# EAGLE design Day0_Rahmadi Rizki S. Pandia (EAGLE 7.5.0)
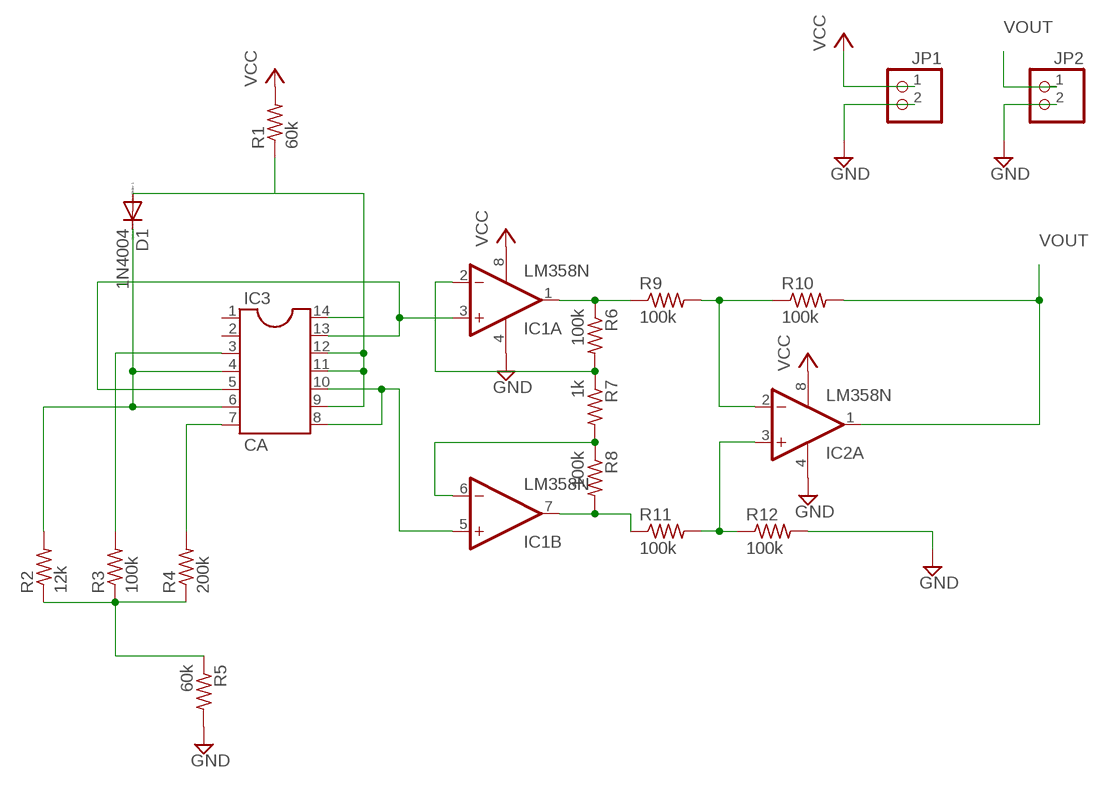
[diagram p0: schematic, sheet 1]

## Parts
D1  1N4004  DIODE-D-7.5  [D-7.5]
IC1  LM358N  [DIL08]
IC2  LM358N  [DIL08]
IC3  CA  DIL14  [DIL14]
JP1  PINHD-1X2  [1X02]
JP2  PINHD-1X2  [1X02]
R1  60k  R-US_0204/7  [0204/7]
R2  12k  R-US_0204/7  [0204/7]
R3  100k  R-US_0204/7  [0204/7]
R4  200k  R-US_0204/7  [0204/7]
R5  60k  R-US_0204/7  [0204/7]
R6  100k  R-US_0204/7  [0204/7]
R7  1k  R-US_0204/7  [0204/7]
R8  100k  R-US_0204/7  [0204/7]
R9  100k  R-US_0204/7  [0204/7]
R10  100k  R-US_0204/7  [0204/7]
R11  100k  R-US_0204/7  [0204/7]
R12  100k  R-US_0204/7  [0204/7]

## Nets
CA3046: IC1.3(A:+IN) IC3.5 IC3.13
GND: IC1.4(P:V-) IC2.4(P:V-) JP1.2 JP2.2 R5.2 R12.2
N$1: D1.A IC3.9 IC3.11 IC3.12 IC3.14 R1.1
N$2: D1.C IC3.4 IC3.6 R2.2
N$4: IC3.3 R3.2
N$5: IC3.7 R4.2
N$6: IC1.2(A:-IN) R6.2 R7.1
N$7: R2.1 R3.1 R4.1 R5.1
N$8: IC1.5(B:+IN) IC3.8 IC3.10
N$9: IC1.6(B:-IN) R7.2 R8.1
N$10: IC1.1(A:OUT) R6.1 R9.1
N$11: IC1.7(B:OUT) R8.2 R11.1
N$12: IC2.2(A:-IN) R9.2 R10.1
N$14: IC2.3(A:+IN) R11.2 R12.1
VCC: IC1.8(P:V+) IC2.8(P:V+) JP1.1 R1.2
VOUT: IC2.1(A:OUT) JP2.1 R10.2
Unconnected: IC2.5(B:+IN) IC2.6(B:-IN) IC2.7(B:OUT) IC3.1 IC3.2

## Library data of the parts
D1 = diode:DIODE-: DIODE
IC1 IC2 = linear:LM358: OP AMP also LM158; LM258; LM2904 Source: http://cache.national.com/ds/LM/LM158.pdf
IC3 = ic-package:DIL14: Dual In Line / Socket
JP1 JP2 = pinhead:PINHD-1X2: PIN HEADER
R1-R12 = rcl:R-US_: RESISTOR, American symbol

## Board
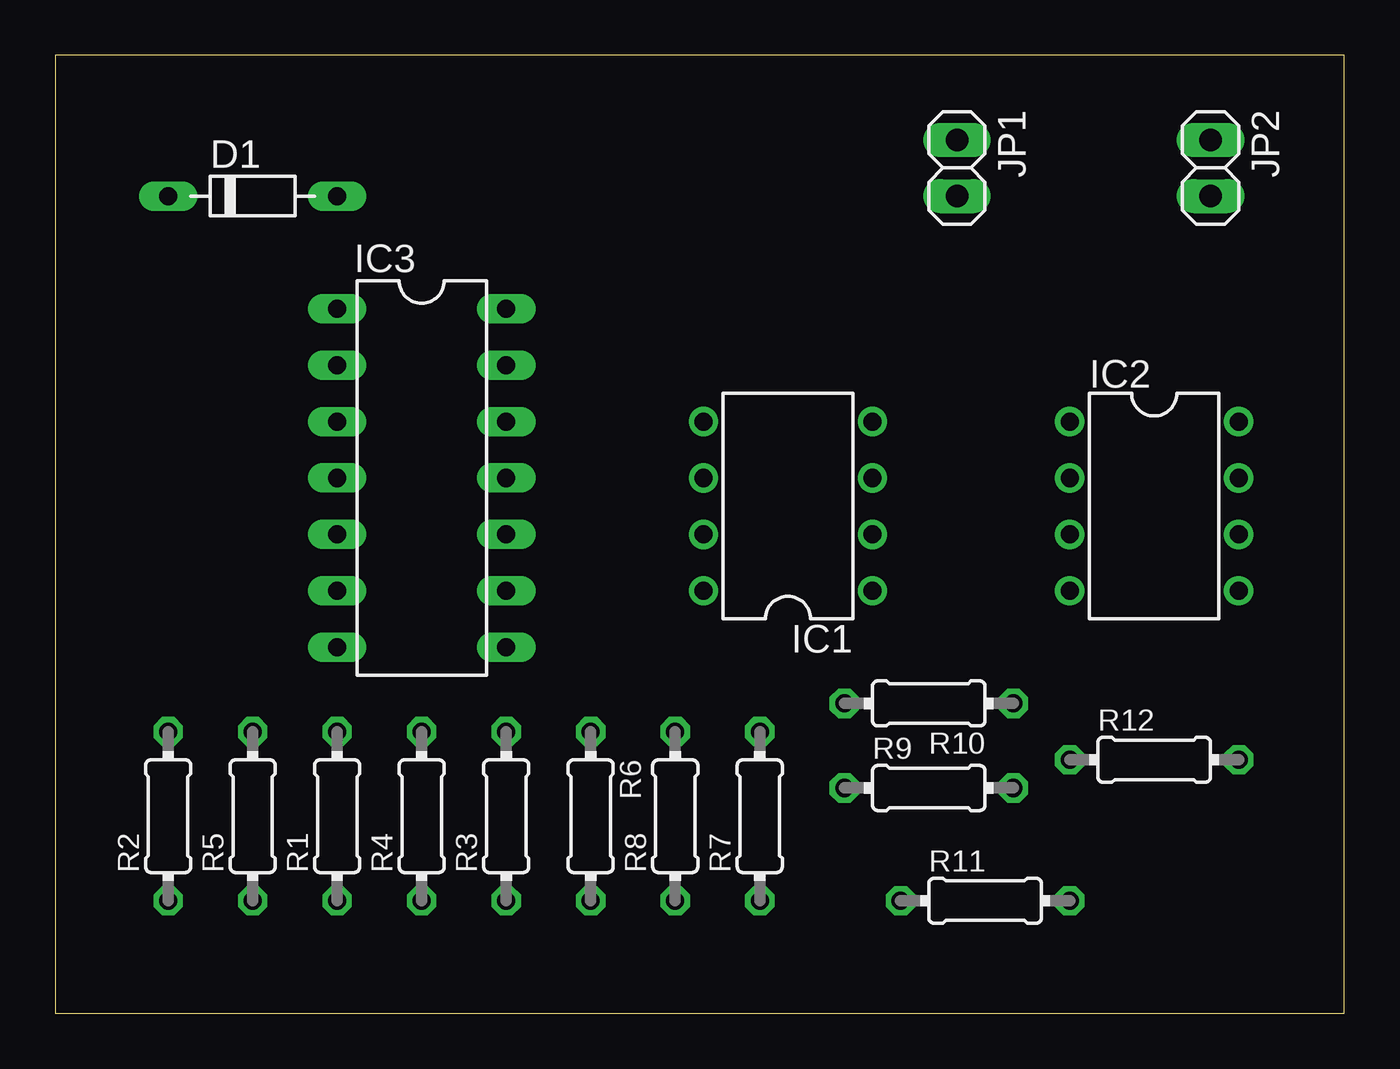
[diagram p1: board, top side]
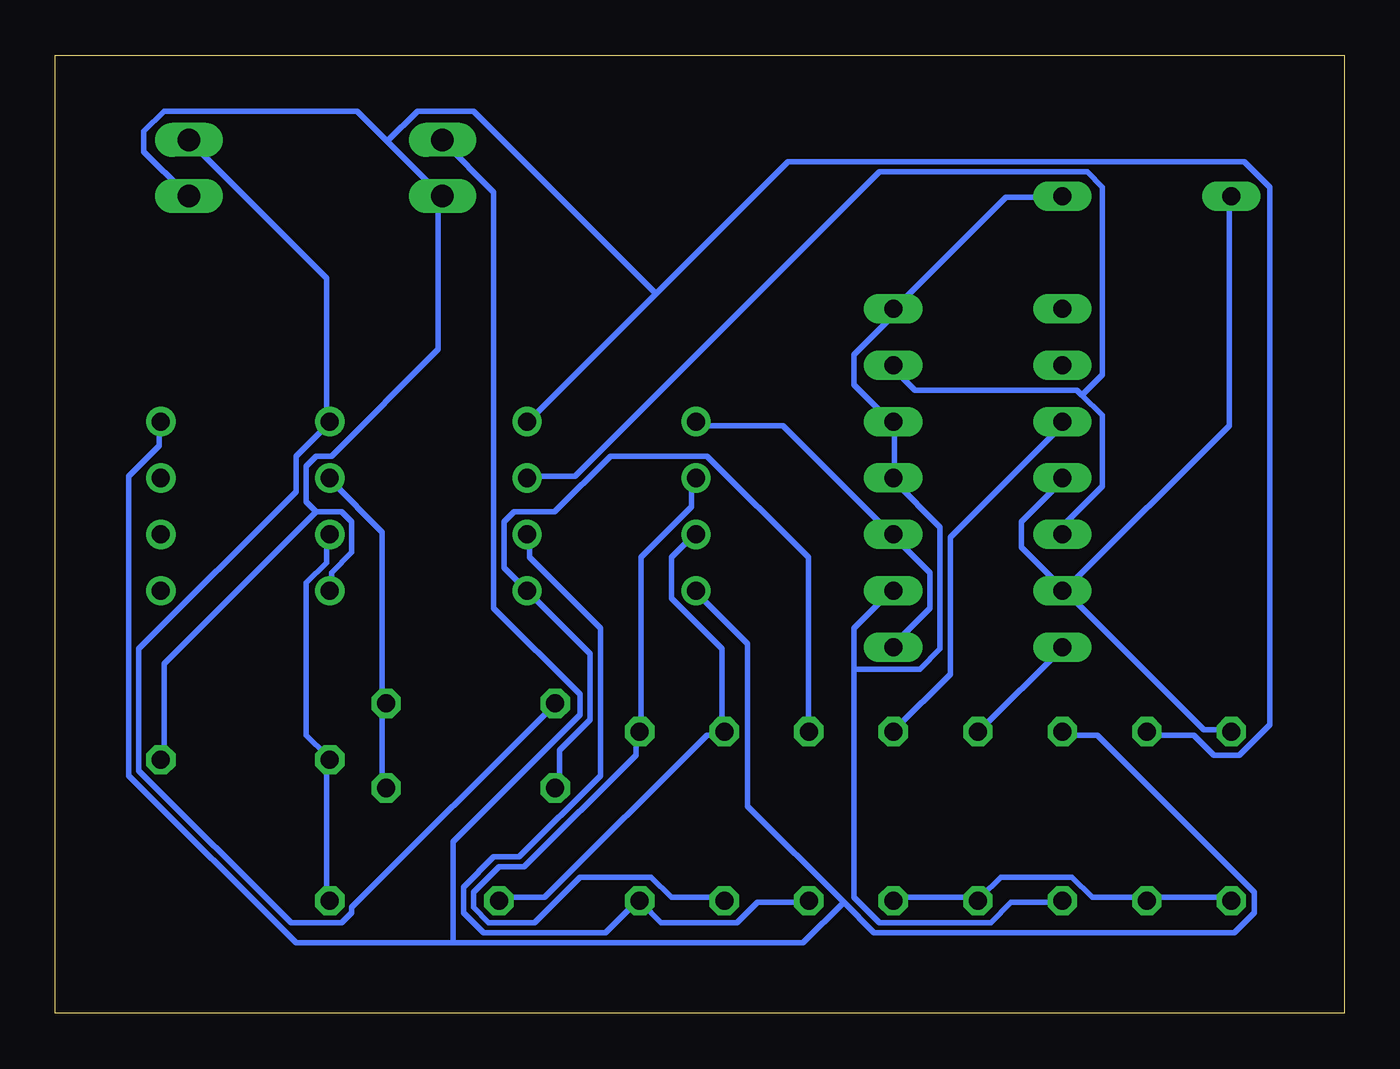
[diagram p2: board, bottom side, seen from below]

Size 58.09 x 43.17 mm. Coordinates in mm from the lower left corner, seen from the top.
Outline: 0,0 58.09,0 58.09,43.17 0,43.17 0,0
Copper layers (1*16): Top 0.035mm / dielectric 1.5mm / Bottom 0.035mm
Design rules "default": minimum track width 10mil, minimum drill 24mil, track to track 8mil, track to pad 8mil, pad to pad 8mil, via to via 8mil, smd to smd 8mil, copper to edge 40mil, drill to drill 8mil, minimum pad ring 10mil, minimum via ring 8mil, stop-mask expansion 4mil, vias tented up to drill 0mil, thermal gap 10mil

### Footprints (pad centres in the part's own frame; a part is rotated, then mirrored left to right if it is on the bottom)
D-7.5 = drill 0.813 long: A 3.81,0; C -3.81,0
DIL08 = drill 0.813 pad 1.27: 1 -3.81,-3.81; 2 -1.27,-3.81; 3 1.27,-3.81; 4 3.81,-3.81; 5 3.81,3.81; 6 1.27,3.81; 7 -1.27,3.81; 8 -3.81,3.81
DIL14 = drill 0.813 long: 1 -7.62,-3.81; 2 -5.08,-3.81; 3 -2.54,-3.81; 4 0,-3.81; 5 2.54,-3.81; 6 5.08,-3.81; 7 7.62,-3.81; 8 7.62,3.81; 9 5.08,3.81; 10 2.54,3.81; 11 0,3.81; 12 -2.54,3.81; 13 -5.08,3.81; 14 -7.62,3.81
1X02 = drill 1.016 long: 1 -1.27,0; 2 1.27,0
0204/7 = drill 0.813 octagon: 1 -3.81,0; 2 3.81,0

### Placement (x,y rotation side)
D1  8.89,36.83 0 top
IC1  33.02,22.86 90 top
IC2  49.53,22.86 270 top
IC3  16.51,24.13 270 top
JP1  40.64,38.1 270 top
JP2  52.07,38.1 270 top
R1  12.7,8.89 90 top
R2  5.08,8.89 90 top
R3  20.32,8.89 90 top
R4  16.51,8.89 90 top
R5  8.89,8.89 90 top
R6  24.13,8.89 270 top
R7  31.75,8.89 90 top
R8  27.94,8.89 90 top
R9  39.37,10.16 0 top
R10  39.37,13.97 180 top
R11  41.91,5.08 0 top
R12  49.53,11.43 0 top

### Tracks (layer width: path | path; a pad name or v marks a point on that pad's centre or on a via)
CA3046
  Bottom 0.254: 11.81,27.86 12.04,28.09 19.36,28.09 20.27,29.01 IC3.13 | 11.81,27.86 10.9,26.95 10.9,23.75 12.5,22.15 12.5,21.69 IC3.5 | 11.81,27.86 10.9,28.78 10.9,37.24 11.58,37.92 20.96,37.92 34.67,24.21 36.73,24.21 IC1.3
GND
  Bottom 0.254: 46.33,22.61 45.19,22.61 44.73,22.15 44.73,20.78 45.64,19.86 45.64,19.18 IC2.4 | 46.33,22.61 53.19,15.75 53.19,11.63 R12.2 | 46.33,22.61 46.79,23.06 46.79,24.66 46.33,25.12 45.64,25.12 40.84,29.92 40.84,36.78 JP1.2 40.84,37.01 43.13,39.29 | 43.13,39.29 44.5,40.67 53.19,40.67 54.1,39.75 54.1,38.84 52.27,37.01 JP2.2 | 31.01,32.44 36.73,26.72 IC1.4 | 31.01,32.44 25.07,38.38 4.5,38.38 3.35,37.24 3.35,13.01 4.72,11.63 5.87,11.63 6.78,12.55 8.84,12.55 R5.2 | 43.13,39.29 41.76,40.67 39.24,40.67 31.01,32.44
N$1
  Bottom 0.254: D1.A 12.73,36.78 15.24,36.78 20.27,31.75 IC3.14 20.5,31.75 20.5,31.29 22.1,29.69 22.1,28.32 20.5,26.72 IC3.12 20.27,26.49 20.27,24.21 IC3.11 20.27,23.98 18.21,21.92 18.21,16.43 19.13,15.52 22.1,15.52 | 22.1,15.52 22.1,17.35 20.5,18.95 IC3.9 | 22.1,15.52 22.1,5.23 20.96,4.09 15.93,4.09 15.01,5 12.73,5 R1.1
N$2
  Bottom 0.254: R2.2 5.18,12.78 6.33,12.78 12.5,18.95 IC3.6 | IC3.4 12.73,23.98 14.55,22.15 14.55,21.01 12.73,19.18 IC3.6 | D1.C 5.18,36.78 5.18,26.49 12.5,19.18 IC3.6
N$4
  Bottom 0.254: IC3.3 12.73,26.49 17.76,21.46 17.76,15.29 20.27,12.78 R3.2
N$5
  Bottom 0.254: IC3.7 12.73,16.43 16.38,12.78 R4.2
N$6
  Bottom 0.254: R6.2 24.16,5 26.44,5 27.36,4.09 30.78,4.09 31.7,5 R7.1 31.93,5 33.3,3.63 38.79,3.63 39.7,4.55 39.7,5.69 38.33,7.06 37.19,7.06 33.53,10.72 33.53,17.35 36.73,20.55 36.73,21.46 IC1.2
N$7
  Bottom 0.254: R2.1 5.18,5.23 8.84,5.23 R5.1 9.07,5.23 11.35,5.23 12.27,6.15 15.47,6.15 16.38,5.23 R4.1 16.61,5.23 20.27,5.23 R3.1
N$8
  Bottom 0.254: IC3.8 20.27,16.66 18.67,18.26 18.67,19.86 20.27,21.46 IC3.10 20.5,21.69 25.3,26.49 29.19,26.49 IC1.5
N$9
  Bottom 0.254: R8.1 28.04,5.23 30.33,5.23 31.24,6.15 34.44,6.15 36.5,4.09 38.56,4.09 39.24,4.77 39.24,5.46 38.1,6.6 36.96,6.6 31.93,11.63 31.93,12.55 R7.2 31.7,12.78 31.7,20.55 29.41,22.84 29.41,23.98 IC1.6
N$10
  Bottom 0.254: R9.1 35.36,10.26 35.36,11.86 33.98,13.23 33.98,16.2 IC1.1 37.87,20.09 37.87,22.15 37.41,22.61 35.59,22.61 33.07,25.12 28.73,25.12 24.16,20.55 24.16,12.78 R6.1
N$11
  Bottom 0.254: IC1.7 29.41,21.46 30.33,20.55 30.33,18.72 28.04,16.43 28.04,12.78 R8.2 28.04,12.55 28.73,12.55 36.04,5.23 38.1,5.23 R11.1
N$12
  Bottom 0.254: R9.2 43.36,10.26 43.36,13.92 R10.1 43.36,14.15 43.36,21.69 45.64,23.98 IC2.2
N$14
  Bottom 0.254: R11.2 45.87,5.23 45.87,11.41 R12.1 45.87,11.63 46.79,12.55 46.79,19.41 45.87,20.32 45.87,21.46 IC2.3
VCC
  Bottom 0.254: 22.56,5 26.9,9.35 26.9,16.66 29.19,18.95 IC1.8 | 22.56,5 21.18,3.63 4.95,3.63 4.04,4.55 4.04,5.46 11.12,12.55 12.5,12.55 R1.2 | 40.16,3.18 24.38,3.18 22.56,5 | 40.16,3.18 47.24,3.18 54.79,10.72 54.79,24.21 53.42,25.58 53.42,26.49 IC2.8 | 40.16,3.18 40.16,7.75 34.44,13.46 34.44,14.38 38.33,18.26 38.33,37.01 40.62,39.29 JP1.1
VOUT
  Bottom 0.254: R10.2 35.59,13.92 44.73,4.77 44.73,4.55 45.19,4.09 47.47,4.09 54.33,10.95 54.33,16.43 47.24,23.52 47.24,25.12 45.87,26.49 IC2.1 45.87,26.72 45.87,33.12 52.05,39.29 JP2.1